# Altium schematic sheet SheetRobotLine.SchDoc
size A4; DocumentNumber: 1; SheetNumber: 1; SheetTotal: 5
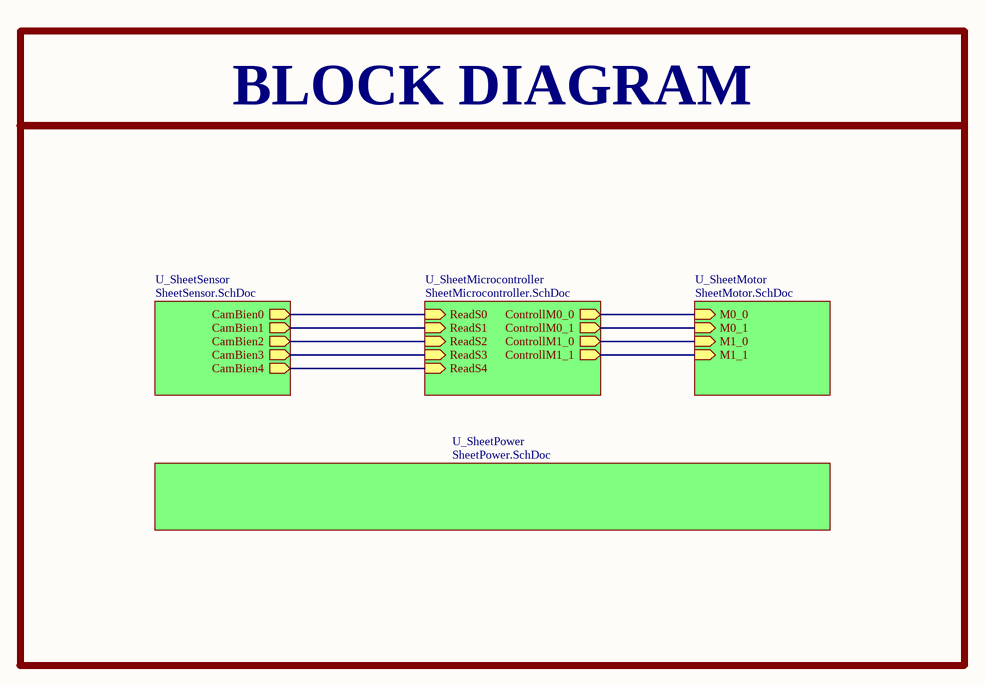
[diagram p0: SheetRobotLine.SchDoc]

## Sub-sheets
U_SheetMicrocontroller = SheetMicrocontroller.SchDoc: ReadS2 (in), ReadS4 (in), ReadS0 (in), ReadS3 (in), ReadS1 (in), ControllM0_0 (out), ControllM0_1 (out), ControllM1_0 (out), ControllM1_1 (out)
U_SheetMotor = SheetMotor.SchDoc: M0_1 (in), M0_0 (in), M1_0 (in), M1_1 (in)
U_SheetPower = SheetPower.SchDoc: no entries
U_SheetSensor = SheetSensor.SchDoc: CamBien4 (out), CamBien3 (out), CamBien2 (out), CamBien1 (out), CamBien0 (out)

## Nets
(unnamed): sheet U_SheetMotor/M0_1, sheet U_SheetMicrocontroller/ControllM0_1
(unnamed): sheet U_SheetMotor/M0_0, sheet U_SheetMicrocontroller/ControllM0_0
(unnamed): sheet U_SheetMotor/M1_0, sheet U_SheetMicrocontroller/ControllM1_0
(unnamed): sheet U_SheetMotor/M1_1, sheet U_SheetMicrocontroller/ControllM1_1
(unnamed): sheet U_SheetMicrocontroller/ReadS2, sheet U_SheetSensor/CamBien2
(unnamed): sheet U_SheetMicrocontroller/ReadS4, sheet U_SheetSensor/CamBien4
(unnamed): sheet U_SheetMicrocontroller/ReadS0, sheet U_SheetSensor/CamBien0
(unnamed): sheet U_SheetMicrocontroller/ReadS3, sheet U_SheetSensor/CamBien3
(unnamed): sheet U_SheetMicrocontroller/ReadS1, sheet U_SheetSensor/CamBien1

## Notes on the sheet
- BLOCK DIAGRAM